# Altium project Infinity.PrjPcb
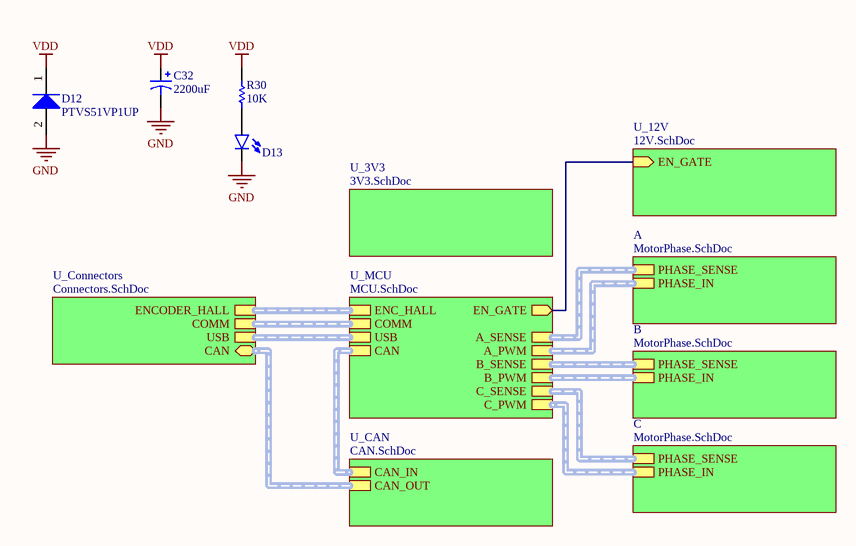
[diagram p0: ESC.SchDoc]
7 sheets, 131 parts. Net scope: hierarchical (ports join the sheet entries above them; power ports are global).
Board file: ESC.PcbDoc
Sheets:
  ESC.SchDoc
    U_12V = 12V.SchDoc
    U_3V3 = 3V3.SchDoc
    U_MCU = MCU.SchDoc
    U_CAN = CAN.SchDoc
    U_Connectors = Connectors.SchDoc
    A = MotorPhase.SchDoc
    B = MotorPhase.SchDoc
    C = MotorPhase.SchDoc

## Sheet ESC.SchDoc
size A; DocumentNumber: 1; SheetNumber: 1; SheetTotal: 6

### Parts
C32  value 2200uF  [CAP-RADIAL-HORZ [18x35.5]]  (hidden comment: CAP 2200uF)
D12  PTVS51VP1UP  [SOD-128]
D13  LED-BLUE  [LED0603]  (value not drawn)
R30  value 10K  [R0603[1608]]  (hidden comment: 10K 1% 0603)

### Sub-sheets
A = MotorPhase.SchDoc: PHASE_SENSE (harness Phase Sense), PHASE_IN (harness Phase Input)
B = MotorPhase.SchDoc: PHASE_SENSE (harness Phase Sense), PHASE_IN (harness Phase Input)
C = MotorPhase.SchDoc: PHASE_SENSE (harness Phase Sense), PHASE_IN (harness Phase Input)
U_3V3 = 3V3.SchDoc: no entries
U_12V = 12V.SchDoc: EN_GATE (in)
U_CAN = CAN.SchDoc: CAN_IN (harness CAN Input), CAN_OUT (harness CAN Output)
U_Connectors = Connectors.SchDoc: USB (harness USB), ENCODER_HALL (harness Encoder/Hall), COMM (harness Comm), CAN
U_MCU = MCU.SchDoc: EN_GATE (out), A_SENSE (harness Phase Sense), A_PWM (harness Phase Input), ENC_HALL (harness Encoder/Hall), COMM (harness Comm), CAN (harness CAN Input), USB (harness USB), B_SENSE (harness Phase Sense), B_PWM (harness Phase Input), C_SENSE (harness Phase Sense), C_PWM (harness Phase Input)

### Nets
GND: C32.2 D12.2(A) D13.C
VDD: C32.1 D12.1(K) R30.2
NetD13_A: D13.A R30.1
NetQ6_1: sheet U_12V/EN_GATE, sheet U_MCU/EN_GATE

### Buses and harness runs
harness sheet A/PHASE_IN = sheet U_MCU/A_PWM
harness sheet A/PHASE_SENSE = sheet U_MCU/A_SENSE
harness sheet B/PHASE_IN = sheet U_MCU/B_PWM
harness sheet B/PHASE_SENSE = sheet U_MCU/B_SENSE
harness sheet C/PHASE_IN = sheet U_MCU/C_PWM
harness sheet C/PHASE_SENSE = sheet U_MCU/C_SENSE
harness sheet U_CAN/CAN_IN = sheet U_MCU/CAN
harness sheet U_CAN/CAN_OUT = sheet U_Connectors/CAN
harness sheet U_Connectors/COMM = sheet U_MCU/COMM
harness sheet U_Connectors/ENCODER_HALL = sheet U_MCU/ENC_HALL
harness sheet U_Connectors/USB = sheet U_MCU/USB

### Library data of the parts
C32 = CAP 2200uF: PartNumber: UVR1J222MHD; Manufacturer: Nichicon; Voltage: 63V; Tolerance: 20%; PackageReference: Radial Capacitor,18x35.5mm; PackageDescription: Radial Capacitor,18x35.5mm, Lead Spacing 7.5mm; Mounting Technology: Through Hole
D12 = PTVS51VP1UP,115: Manufacturer: NXP; PartNumber: PTVS51VP1UP,115; PackageReference: SOD-128; PackageDescription: SOD128, 2-Leads; Mounting Technology: Surface Mount
D13 = LED_0603_BLUE_5mA: PartNumber: LTST-C193TBKT-5A; Manufacturer: Lite-On Inc.; PackageReference: 0603; PackageDescription: 0603 (1608 Metric); Mounting Technology: Surface Mount
R30 = RES_10K_0603_1%: 10K 0.25W 1% 0603 (1005 Metric); Manufacturer: Vishay; PartNumber: RCS060310K0FKEA; Tolerance: 1%; Power: 0.25W; Mounting Technology: Surface Mount; PackageReference: 0603; PackageDescription: 0603 (1608 Metric); ComponentLink1Description: Datasheet; ComponentLink1URL: http://www.vishay.com/docs/20065/rcse3.pdf

## Sheet 12V.SchDoc
size A; DocumentNumber: 4; SheetNumber: 4; SheetTotal: 6
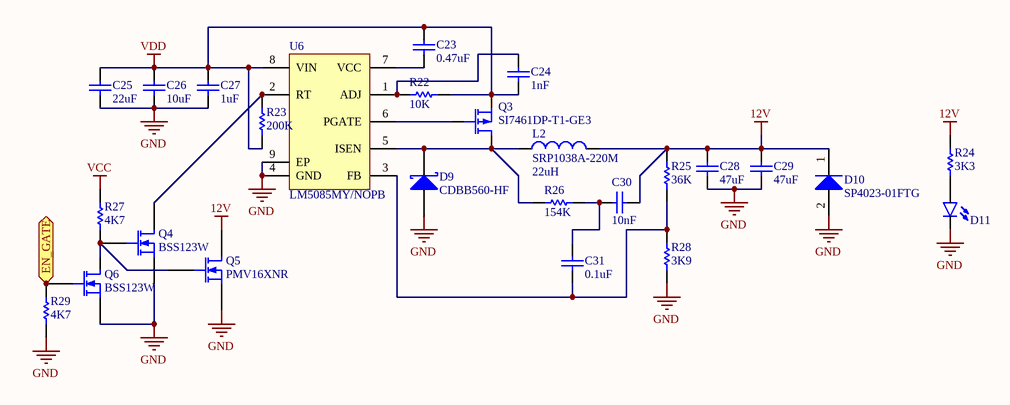
[diagram p1: 12V.SchDoc]

### Parts
(Parts that share a designator on the sheet are numbered #1, #2 ... from top to bottom, then left to right.)
C23  value 0.47uF  [C0603[1608X92]]  (hidden comment: 0.47uF 50V 0603)
C24  value 1nF  [C0402[1005X55]]  (hidden comment: 1nF 50V 0402)
C25#1  value 22uF  [C2220[5750X480]]  (hidden comment: 22uF 50V 2220)
C26  value 10uF  [C1206[3216X160]]  (hidden comment: 10uF 50V 1206)
C27  value 1uF  [C0603[1608X92]]  (hidden comment: 1uF 50V 0603)
C28  value 47uF  [C1210[3225X250]]  (hidden comment: 47uF 16V 1210)
C29  value 47uF  [C1210[3225X250]]  (hidden comment: 47uF 16V 1210)
C30  value 10nF  [C0402[1005X55]]  (hidden comment: 10nF 50V 0402)
C31  value 0.1uF  [C0402[1005X55]]  (hidden comment: 0.1uF 100VV 0402)
D9  CDBB560-HF  [SMB]
D10  SP4023-01FTG  [SOD323]
D11  LED-BLUE  [LED0603]  (value not drawn)
L2  SRP1038A-220M  value 22uH  [SRP1038A]
Q3  SI7461DP-T1-GE3  [SOT23-3]
Q4#1  BSS123W  [SOT323-3]
Q5  PMV16XNR  [SOT23-3]
Q6  BSS123W  [DPAK127P1525X483-7N]
R22  value 10K  [R0402[1005]]  (hidden comment: 10K 1% 0402)
R23  value 200K  [R0402[1005]]  (hidden comment: 200K 1% 0402)
R24  value 3K3  [R0402[1005]]  (hidden comment: 3K3 1% 0402)
R25  value 36K  [R0402[1005]]  (hidden comment: 36K 1% 0402)
R26  value 154K  [R0402[1005]]  (hidden comment: 154K 1% 0402)
R27  value 4K7  [R0402[1005]]  (hidden comment: 4K7 1% 0402)
R28#1  value 3K9  [R0402[1005]]  (hidden comment: 3K9 1% 0402)
R29  value 4K7  [R0402[1005]]  (hidden comment: 4K7 1% 0402)
U6  LM5085MY/NOPB  [MUY08A_N]

### Ports
EN_GATE (in)

### Nets
12V: C28.2 C29.2 C30.2 D10.1(K) L2.2 Q5.3(D) R24.2 R25.2
GND: C25#1.1 C26.1 C27.1 C28.1 C29.1 D9.1(A) D10.2(A) D11.C Q4#1.2(S) Q5.2(S) Q6.2(S) R28#1.1 R29.1 U6.4(GND) U6.9(EP)
VCC: R27.2
VDD: C23.2 C24.1 C25#1.2 C26.2 C27.2 Q3.3(S) R22.2 R23.1 U6.8(VIN)
NetC23_1: C23.1 U6.7(VCC)
NetC24_2: C24.2 R22.1 U6.1(ADJ)
NetC30_1: C30.1 C31.2 R26.2
NetC31_1: C31.1 R25.1 R28#1.2 U6.3(FB)
NetD9_2: D9.2(K) L2.1 Q3.2(D) R26.1 U6.5(ISEN)
NetD11_A: D11.A R24.1
NetQ3_1: Q3.1(G) U6.6(PGATE)
NetQ4#1_1: Q4#1.1(G) Q5.1(G) Q6.3(D) R27.1
NetQ4#1_3: Q4#1.3(D) R23.2 U6.2(RT)
NetQ6_1: Q6.1(G) R29.2 ; port EN_GATE

### Library data of the parts
C23 = CAP_0.47uF_50V_0603_10%: 0.47uF 50V 10% 0603 (1608 Metric); PartNumber: GRM188R61H474KA12D; Manufacturer: Murata; Tolerance: 10%; Mounting Technology: Surface Mount; PackageReference: 0603; PackageDescription: 0603 (1608 Metric); Voltage: 50V
C24 = CAP_1nF_50V_0402_5%: 1nF 50V 5% 0402 (1005 Metric); PartNumber: GRM1555C1H102JA01D; Manufacturer: Murata; Tolerance: 5%; Mounting Technology: Surface Mount; PackageReference: 0402; PackageDescription: 0402 (1005 Metric); Voltage: 50V
C25#1 = CAP_22uF_50V_2220_20%: 22uF 50V 20% 2220 (5750 Metric); PartNumber: KRM55TR71H226MH01K; Manufacturer: Murata; Tolerance: 20%; Mounting Technology: Surface Mount; PackageReference: 2220; PackageDescription: 2220 (5750 Metric); Voltage: 50V
C26 = CAP_10uF_50V_1206_20%: 10uF 50V 20% 1206 (3216 Metric); PartNumber: UMK316BBJ106ML-T; Manufacturer: Taiyo Yuden; Tolerance: 20%; Mounting Technology: Surface Mount; PackageReference: 1206; PackageDescription: 1206 (3216 Metric); Voltage: 50V
C27 = CAP_1uF_50V_0603_10%: 1uF 50V 10% 0603 (1608 Metric); PartNumber: GRM188R61H105KAALD; Manufacturer: Murata; Tolerance: 10%; Mounting Technology: Surface Mount; PackageReference: 0603; PackageDescription: 0603 (1608 Metric); Voltage: 50V
C28 C29 = CAP_47uF_16V_1210_20%: 47uF 16V 20% 1210 (3225 Metric); PartNumber: GRM32ER61C476ME15L; Manufacturer: Murata; Tolerance: 20%; Mounting Technology: Surface Mount; PackageReference: 1210; PackageDescription: 1210 (3225 Metric); Voltage: 16V
C30 = CAP_10nF_50V_0402_10%: 10nF 50V 10% 0402 (1005 Metric); PartNumber: GCM155R71H103KA55D; Manufacturer: Murata; Tolerance: 10%; Mounting Technology: Surface Mount; PackageReference: 0402; PackageDescription: 0402 (1005 Metric); Voltage: 50V
C31 = CAP_0.1uF_100V_0402_10%: 0.1uF 100V 10% 0402 (1005 Metric); PartNumber: GRM155R62A104KE14D; Manufacturer: Murata; Tolerance: 10%; Mounting Technology: Surface Mount; PackageReference: 0402; PackageDescription: 0402 (1005 Metric); Voltage: 100V
D9 = CDBB560-HF: Manufacturer: Comchip Technology; PackageReference: DO-214AA; PackageDescription: DO-214-AA/SMB; 2 C-Bend Leads; Body 5.3 x 3.6 mm, inc. leads (LxW); PartNumber: CDBB560-HF; Mounting Technology: Surface Mount
D10 = SP4023-01FTG: Manufacturer: Littelfuse; PartNumber: SP4023-01FTG; PackageReference: SOD-323-2; PackageDescription: SOD323, 2-Leads; Mounting Technology: Surface Mount
D11 = LED_0603_BLUE_5mA: as D13 on sheet ESC; PackageReference: 0603; PackageDescription: 0603 (1608 Metric); Mounting Technology: Surface Mount
L2 = SRP1038A-220M: 22uH 20% 7A 1038; Manufacturer: Bourns; PackageReference: SRP1038A; PartNumber: SRP1038A-220M; Mounting Technology: Surface Mount
Q3 = SI7461DP-T1-GE3: P-Channel MOSFET; Manufacturer: Vishay; PackageReference: PowerPAK SO-8; PartNumber: SI7461DP-T1-GE3; Mounting Technology: Surface Mount
Q4#1 Q6 = BSS123WQ-7-F: N-Channel MOSFET; Manufacturer: Diodes Incorporated; PackageReference: SOT-323-3; PartNumber: BSS123WQ-7-F; Mounting Technology: Surface Mount
Q5 = PMV16XNR: N-Channel MOSFET; pin to pad: 2>3 3>2; Manufacturer: NXP; PackageReference: SOT-23-3; PartNumber: PMV16XNR; Mounting Technology: Surface Mount
R22 = RES_10K_0402_1%: 10K 0.063W 1% 0402 (1005 Metric); Manufacturer: KOA Speer; PartNumber: RK73H1ETTP1002F; Tolerance: 1%; Power: 0.063W; Mounting Technology: Surface Mount; PackageReference: 0402; PackageDescription: 0402 (1005 Metric); ComponentLink1Description: Datasheet; ComponentLink1URL: http://www.koaspeer.com/catimages/Products/RK73H/RK73H.pdf
R23 = RES_200K_0402_1%: 200K 0.063W 1% 0402 (1005 Metric); Manufacturer: KOA Speer; PartNumber: RK73H1ETTP2003F; Tolerance: 1%; Power: 0.063W; Mounting Technology: Surface Mount; PackageReference: 0402; PackageDescription: 0402 (1005 Metric); ComponentLink1Description: Datasheet; ComponentLink1URL: http://www.koaspeer.com/catimages/Products/RK73H/RK73H.pdf
R24 = RES_3K3_0402_1%: 3K3 0.063W 1% 0402 (1005 Metric); Manufacturer: KOA Speer; PartNumber: RK73H1ETTP3301F; Power: 0.063W; Tolerance: 1%; Mounting Technology: Surface Mount; PackageReference: 0402; PackageDescription: 0402 (1005 Metric); ComponentLink1Description: Datasheet; ComponentLink1URL: http://www.koaspeer.com/catimages/Products/RK73H/RK73H.pdf
R25 = RES_36K_0402_1%: 36K 0.063W 1% 0402 (1005 Metric); Manufacturer: KOA Speer; PartNumber: RK73H1ETTP3602F; Power: 0.063W; Tolerance: 1%; Mounting Technology: Surface Mount; PackageReference: 0402; PackageDescription: 0402 (1005 Metric); ComponentLink1Description: Datasheet; ComponentLink1URL: http://www.koaspeer.com/catimages/Products/RK73H/RK73H.pdf
R26 = RES_154K_0402_1%: 154K 0.063W 1% 0402 (1005 Metric); Manufacturer: KOA Speer; PartNumber: RK73H1ETTP1543F; Power: 0.063W; Tolerance: 1%; Mounting Technology: Surface Mount; PackageReference: 0402; PackageDescription: 0402 (1005 Metric); ComponentLink1Description: Datasheet; ComponentLink1URL: http://www.koaspeer.com/catimages/Products/RK73H/RK73H.pdf
R27 R29 = RES_4K7_0402_1%: 4K7 0.063W 1% 0402 (1005 Metric); Manufacturer: KOA Speer; PartNumber: RK73H1ETTP4701F; Tolerance: 1%; Power: 0.063W; Mounting Technology: Surface Mount; PackageReference: 0402; PackageDescription: 0402 (1005 Metric); ComponentLink1Description: Datasheet; ComponentLink1URL: http://www.koaspeer.com/catimages/Products/RK73H/RK73H.pdf
R28#1 = RES_3K9_0402_1%: 3K9 0.063W 1% 0402 (1005 Metric); Manufacturer: KOA Speer; PartNumber: RK73H1ETTP3901F; Tolerance: 1%; Power: 0.063W; Mounting Technology: Surface Mount; PackageReference: 0402; PackageDescription: 0402 (1005 Metric); ComponentLink1Description: Datasheet; ComponentLink1URL: http://www.koaspeer.com/catimages/Products/RK73H/RK73H.pdf
U6 = CMP-0069-01314-2: 75V Constant On-Time PFET Buck Switching Controller, 8-pin eMSOP, Pb-Free; Manufacturer: Texas Instruments; CompType: Switcher; PackageTopMarking: ZXTT*SYCB; PowerWise: Y; ComponentLink3Description: MUY08A Package Page; ComponentLink1URL: http://www.national.com/ds/LM/LM5085.pdf; PackageReference: MSOP-8; RevisionNote: Component URLs added; ComponentLink3URL: http://www.national.com/packaging/folders/muy08a.html; DatasheetVersion: Dec-2009; ComponentLink1Description: LM5085 Datasheet; ComponentLink2URL: http://www.national.com/pf/LM/LM5085.html; RoHS: Y; PackageVersion: revA, Nov-2003; Code_JEDEC: MO-187-AA; PackageDescription: Molded Mini-SO, Exposed Pad, .118 x .118 x .034in Body, 8 Lead, .0256in Pitch; ComponentLink2Description: LM5085 Web Page; PinCount: 8; Mounting Technology: Surface Mount; PartNumber: LM5085MY

## Sheet 3V3.SchDoc
size A; DocumentNumber: 5; SheetNumber: 5; SheetTotal: 6
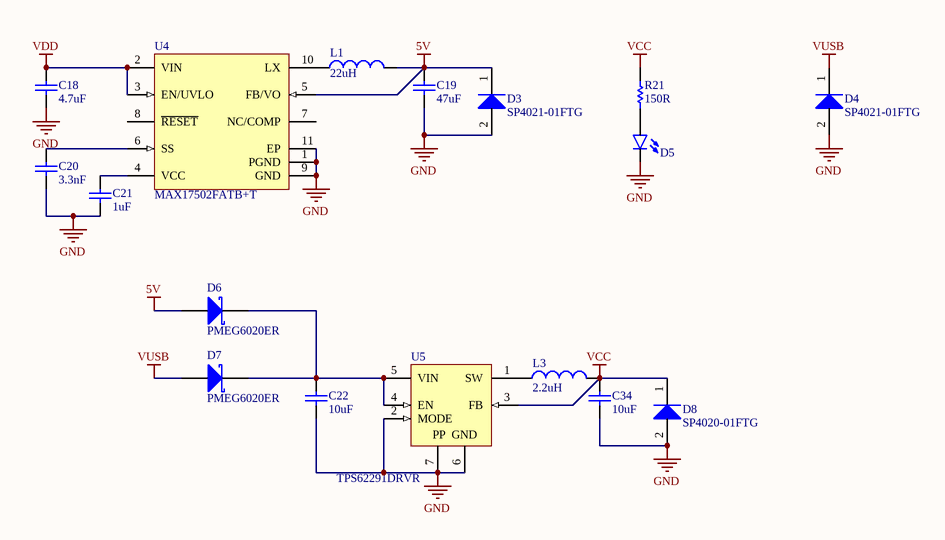
[diagram p2: 3V3.SchDoc]

### Parts
(Parts that share a designator on the sheet are numbered #1, #2 ... from top to bottom, then left to right.)
C18  value 4.7uF  [C1210[3225X200]]  (hidden comment: 4.7uF 100V 1210)
C19  value 47uF  [C1210[3225X250]]  (hidden comment: 47uF 6.3V 1210)
C20  value 3.3nF  [C0402[1005X55]]  (hidden comment: 3.3nF 50V 0402)
C21  value 1uF  [C0402[1005X55]]  (hidden comment: 1uF 6.3V 0402)
C22  value 10uF  [C0402[1005X55]]  (hidden comment: 10uF 6.3V 0402)
C34  value 10uF  [C0402[1005X55]]  (hidden comment: 10uF 6.3V 0402)
D3#1  SP4021-01FTG  [SOD323]
D4  SP4021-01FTG  [SOD323]
D5  LED-BLUE  [LED0603]  (value not drawn)
D6  PMEG6020ER  [ONSC-SOD-123-2-425-04_V]
D7  PMEG6020ER  [ONSC-SOD-123-2-425-04_V]
D8  SP4020-01FTG  [SOD323]
L1  value 22uH  [SDR0805-180ML]
L3  2.2uH  [IND0805]
R21  value 150R  [R0402[1005]]  (hidden comment: 150R 1% 0402)
U4#1  MAX17502FATB+T  [TDFN-10-EP]
U5  TPS62291DRVR  [WSON-6]

### Nets
5V: C19.2 D3#1.1(K) D6.2(A) L1.2 U4#1.5(FB/VO)
GND: C18.1 C19.1 C20.1 C21.1 C22.1 C34.1 D3#1.2(A) D4.2(A) D5.C D8.2(A) U4#1.1(PGND) U4#1.9(GND) U4#1.11(EP) U5.2(MODE) U5.6(GND) U5.7(EP)
VCC: C34.2 D8.1(K) L3.2 R21.2 U5.3(FB)
VDD: C18.2 U4#1.2(VIN) U4#1.3(EN/UVLO)
VUSB: D4.1(K) D7.2(A)
NetC20_2: C20.2 U4#1.6(SS)
NetC21_2: C21.2 U4#1.4(VCC)
NetC22_2: C22.2 D6.1(K) D7.1(K) U5.4(EN) U5.5(VIN)
NetD5_A: D5.A R21.1
NetL1_1: L1.1 U4#1.10(LX)
NetL3_1: L3.1 U5.1(SW)

Not connected (* = marked no-connect by the designer): U4#1 7(NC/COMP) 8(~{RESET})

### Notes on the sheet
- (in symbol TPS62291DRVR) PP

### Library data of the parts
C18 = CAP_4.7uF_100V_1210_10%: 4.7uF 100V 10% 1210 (3225 Metric); PartNumber: GRJ32DC72A475KE11L; Manufacturer: Murata; Tolerance: 10%; Mounting Technology: Surface Mount; PackageReference: 1210; PackageDescription: 1210 (3225 Metric); Voltage: 100V
C19 = CAP_47uF_6.3V_1210_10%: 47uF 6.3V 10% 1210 (3225 Metric); PartNumber: GRM32ER70J476KE20L; Manufacturer: Murata; Tolerance: 10%; Mounting Technology: Surface Mount; PackageReference: 1210; PackageDescription: 1210 (3225 Metric); Voltage: 6.3V
C20 = CAP_3.3nF_50V_0402_10%: 3.3nF 50V 10% 0402 (1005 Metric); PartNumber: GRM155R71H332KA01D; Manufacturer: Murata; Tolerance: 10%; Mounting Technology: Surface Mount; PackageReference: 0402; PackageDescription: 0402 (1005 Metric); Voltage: 50V
C21 = CAP_1uF_6.3V_0402_10%: 1uF 6.3V 10% 0402 (1005 Metric); PartNumber: GRM155R70J105KA12D; Manufacturer: Murata; Tolerance: 10%; Mounting Technology: Surface Mount; PackageReference: 0402; PackageDescription: 0402 (1005 Metric); Voltage: 6.3V
C22 C34 = CAP_10uF_6.3V_0402_20%: 10uF 6.3V 20% 0402 (1005 Metric); PartNumber: GRM155R60J106ME44D; Manufacturer: Murata; Tolerance: 20%; Mounting Technology: Surface Mount; PackageReference: 0402; PackageDescription: 0402 (1005 Metric); Voltage: 6.3V
D3#1 D4 = SP4021-01FTG: Manufacturer: Littelfuse; PartNumber: SP4021-01FTG; PackageReference: SOD-323-2; Mounting Technology: Surface Mount
D5 = LED_0603_BLUE_5mA: as D13 on sheet ESC; PackageReference: 0603; PackageDescription: 0603 (1608 Metric); Mounting Technology: Surface Mount
D6 D7 = PMEG6020ER: PartNumber: PMEG6020ER,115; Manufacturer: NXP Semiconductors; PackageReference: SOD-123W; PackageDescription: SOD, 2-Leads, Body 2.69x1.6mm; Mounting Technology: Surface Mount
D8 = SP4020-01FTG: Manufacturer: Littelfuse; PartNumber: SP4020-01FTG; PackageReference: SOD-323-2; Mounting Technology: Surface Mount
L1 = SDR0604-220YL: 22uH 30% 1.1A 0604; Manufacturer: Bourns; PackageReference: SDR0604; PartNumber: SDR0604-220YL; Mounting Technology: Surface Mount
L3 = IND_2.2uH_1.7A_0805_20%: 2.2uH 20% 1.7A 0805; PartNumber: LQM21PN2R2MGHL; Manufacturer: Murata; PackageReference: 0805; PackageDescription: 0805 (2012 metric); Value: 2.2uH; Mounting Technology: Surface Mount; Current: 1.7A
R21 = RES_150R_0402_1%: 150R 0.063W 1% 0402 (1005 Metric); Manufacturer: KOA Speer; PartNumber: RK73H1ETTP1500F; Power: 0.063W; Tolerance: 1%; Mounting Technology: Surface Mount; PackageReference: 0402; PackageDescription: 0402 (1005 Metric); ComponentLink1Description: Datasheet; ComponentLink1URL: http://www.koaspeer.com/catimages/Products/RK73H/RK73H.pdf
U4#1 = MAX17502FATB+T: Manufacturer: Maxim Integrated; Mounting Technology: Surface Mount; PartNumber: MAX17502FATB+T; PackageReference: TDFN-10-EP
U5 = TPS62291DRVR: Voltage Regulators - Switching Regulators 2.25MHz 1A Step-Down Cnvrtr 3.3V Output; Manufacturer: Texas Instruments; PartNumber: TPS62291DRVR; PackageReference: WSON-6; PackageDescription: SON, 6-Leads, Body 2x2mm, Pitch 0.65mm, Thermal Pad 1.6x1mm, TI Recommended; Mounting Technology: Surface Mount

## Sheet MCU.SchDoc
size A; DocumentNumber: 2; SheetNumber: 2; SheetTotal: 6
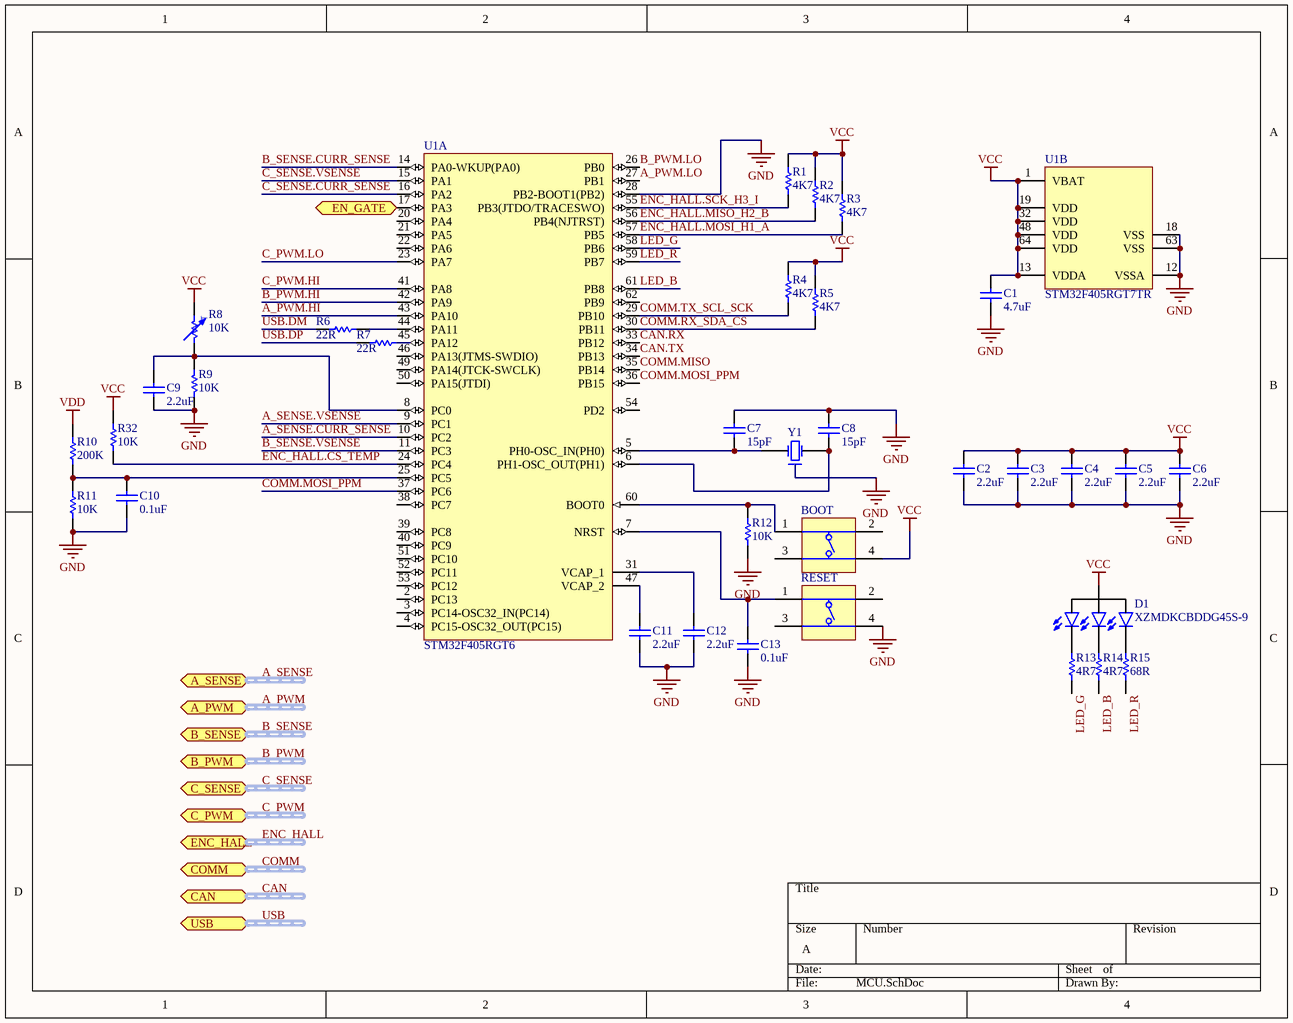
[diagram p3: MCU.SchDoc]

### Parts
(Parts that share a designator on the sheet are numbered #1, #2 ... from top to bottom, then left to right.)
BOOT  (no value)  [SWITCH]
C1  value 4.7uF  [C0402[1005X55]]  (hidden comment: 4.7uF 6.3V 0402)
C2  value 2.2uF  [C0402[1005X55]]  (hidden comment: 2.2uF 6.3V 0402)
C3  value 2.2uF  [C0402[1005X55]]  (hidden comment: 2.2uF 6.3V 0402)
C4  value 2.2uF  [C0402[1005X55]]  (hidden comment: 2.2uF 6.3V 0402)
C5  value 2.2uF  [C0402[1005X55]]  (hidden comment: 2.2uF 6.3V 0402)
C6  value 2.2uF  [C0402[1005X55]]  (hidden comment: 2.2uF 6.3V 0402)
C7  value 15pF  [C0402[1005X55]]  (hidden comment: 15pF 50V 0402)
C8  value 15pF  [C0402[1005X55]]  (hidden comment: 15pF 50V 0402)
C9  value 2.2uF  [C0402[1005X55]]  (hidden comment: 2.2uF 6.3V 0402)
C10  value 0.1uF  [C0402[1005X55]]  (hidden comment: 0.1uF 6.3V 0402)
C11  value 2.2uF  [C0402[1005X55]]  (hidden comment: 2.2uF 6.3V 0402)
C12  value 2.2uF  [C0402[1005X55]]  (hidden comment: 2.2uF 6.3V 0402)
C13  value 0.1uF  [C0402[1005X55]]  (hidden comment: 0.1uF 6.3V 0402)
D1  XZMDKCBDDG45S-9  [XZMDKCBDDG45S-9]
R1  value 4K7  [R0402[1005]]  (hidden comment: 4K7 1% 0402)
R2  value 4K7  [R0402[1005]]  (hidden comment: 4K7 1% 0402)
R3  value 4K7  [R0402[1005]]  (hidden comment: 4K7 1% 0402)
R4  value 4K7  [R0402[1005]]  (hidden comment: 4K7 1% 0402)
R5  value 4K7  [R0402[1005]]  (hidden comment: 4K7 1% 0402)
R6  value 22R  [R0402[1005]]  (hidden comment: 22R 1% 0402)
R7#1  value 22R  [R0402[1005]]  (hidden comment: 22R 1% 0402)
R8  value 10K  [R0402[1005]]  (hidden comment: 10K 0.5% 0402)
R9  value 10K  [R0402[1005]]  (hidden comment: 10K 1% 0402)
R10#1  value 200K  [R0402[1005]]  (hidden comment: 200K 1% 0402)
R11  value 10K  [R0402[1005]]  (hidden comment: 10K 1% 0402)
R12  value 10K  [R0402[1005]]  (hidden comment: 10K 1% 0402)
R13#1  value 4R7  [R0402[1005]]  (hidden comment: 4R7 1% 0402)
R14  value 4R7  [R0402[1005]]  (hidden comment: 4R7 1% 0402)
R15  value 68R  [R0402[1005]]  (hidden comment: 68R 1% 0402)
R32  value 10K  [R0402[1005]]  (hidden comment: 10K 1% 0402)
RESET  (no value)  [SWITCH]
U1#1  STM32F405RGT6  [STM-LQFP64_L]  (part A of 2)
U1#2  STM32F405RGT7TR  [STM-LQFP64_V]  (part B of 2)
Y1  (no value)  [ABRA-ABM3B-4_V]

### Ports
A_PWM (harness Phase Input), A_SENSE (harness Phase Sense), B_PWM (harness Phase Input), B_SENSE (harness Phase Sense), C_PWM (harness Phase Input), C_SENSE (harness Phase Sense), CAN (harness CAN Input), COMM (harness Comm), EN_GATE (out), ENC_HALL (harness Encoder/Hall), USB (harness USB)

### Nets
GND: C1.1 C2.1 C3.1 C4.1 C5.1 C6.1 C7.2 C8.2 C9.1 C10.1 C11.1 C12.1 C13.1 R9.1 R11.1 R12.1 RESET.4(T3) U1#1.28(PB2-BOOT1(PB2)) U1#2.12(VSSA) U1#2.18(VSS) U1#2.63(VSS) Y1.2
VCC: BOOT.4(T3) C1.2 C2.2 C3.2 C4.2 C5.2 C6.2 D1.2(A) R1.2 R2.2 R3.2 R4.2 R5.2 R8.2 R32.2 U1#2.1(VBAT) U1#2.13(VDDA) U1#2.19(VDD) U1#2.32(VDD) U1#2.48(VDD) U1#2.64(VDD)
VDD: R10#1.1
A_PWM.HI: U1#1.43(PA10)
A_PWM.LO: U1#1.27(PB1)
A_SENSE.CURR_SENSE: U1#1.10(PC2)
A_SENSE.VSENSE: U1#1.9(PC1)
B_PWM.HI: U1#1.42(PA9)
B_PWM.LO: U1#1.26(PB0)
B_SENSE.CURR_SENSE: U1#1.14(PA0-WKUP(PA0))
B_SENSE.VSENSE: U1#1.11(PC3)
C_PWM.HI: U1#1.41(PA8)
C_PWM.LO: U1#1.23(PA7)
C_SENSE.CURR_SENSE: U1#1.16(PA2)
C_SENSE.VSENSE: U1#1.15(PA1)
CAN.RX: U1#1.33(PB12)
CAN.TX: U1#1.34(PB13)
COMM.MISO: U1#1.35(PB14)
COMM.MOSI_PPM: U1#1.36(PB15) U1#1.37(PC6)
COMM.RX_SDA_CS: R5.1 U1#1.30(PB11)
COMM.TX_SCL_SCK: R4.1 U1#1.29(PB10)
ENC_HALL.CS_TEMP: R32.1 U1#1.24(PC4)
ENC_HALL.MISO_H2_B: R2.1 U1#1.56(PB4(NJTRST))
ENC_HALL.MOSI_H1_A: R3.1 U1#1.57(PB5)
ENC_HALL.SCK_H3_I: R1.1 U1#1.55(PB3(JTDO/TRACESWO))
LED_B: R14.1 U1#1.61(PB8)
LED_G: R13#1.1 U1#1.58(PB6)
LED_R: R15.1 U1#1.59(PB7)
USB.DM: R6.1
USB.DP: R7#1.1
NetBOOT_1: BOOT.1(T1) R12.2 U1#1.60(BOOT0)
NetC7_1: C7.1 U1#1.5(PH0-OSC_IN(PH0)) Y1.3(X2)
NetC8_1: C8.1 U1#1.6(PH1-OSC_OUT(PH1)) Y1.1(X1)
NetC9_2: C9.2 R8.1 R9.2 U1#1.8(PC0)
NetC10_2: C10.2 R10#1.2 R11.2 U1#1.25(PC5)
NetC11_2: C11.2 U1#1.47(VCAP_2)
NetC12_2: C12.2 U1#1.31(VCAP_1)
NetC13_2: C13.2 RESET.1(T1) U1#1.7(NRST)
NetD1_1: D1.1(K_Red) R15.2
NetD1_3: D1.3(K_Blue) R14.2
NetD1_4: D1.4(K_Green) R13#1.2
NetQ6_1: U1#1.17(PA3) ; port EN_GATE
NetR6_2: R6.2 U1#1.44(PA11)
NetR7#1_2: R7#1.2 U1#1.45(PA12)

Not connected (* = marked no-connect by the designer): BOOT 2(T2) 3(T3); RESET 2(T2) 3(T3); U1#1 2(PC13) 3(PC14-OSC32_IN(PC14)) 4(PC15-OSC32_OUT(PC15)) 20(PA4) 21(PA5) 22(PA6) 38(PC7) 39(PC8) 40(PC9) 46(PA13(JTMS-SWDIO)) 49(PA14(JTCK-SWCLK)) 50(PA15(JTDI)) 51(PC10) 52(PC11) 53(PC12) 54(PD2) 62(PB9)

### Buses and harness runs
harness A_PWM = port A_PWM
harness A_SENSE = port A_SENSE
harness B_PWM = port B_PWM
harness B_SENSE = port B_SENSE
harness C_PWM = port C_PWM
harness C_SENSE = port C_SENSE
harness CAN = port CAN
harness COMM = port COMM
harness ENC_HALL = port ENC_HALL
harness USB = port USB

### Notes on the sheet
- (in symbol NTC_10K_0402_0.5%) T

### Library data of the parts
BOOT RESET = DIPT-DTSM-6: Switch, SPNO Push Button SMD; Manufacturer: C&K Components; PartNumber: PTS810 SJM 250 SMTR LFS; Packing Type: Tape&Reel; Mechanical Life: 200,000 cycles; ComponentLink2URL: http://www.dip.com.tw/Products_tact.htm; ComponentLink1URL: http://www.dip.com.tw/; ComponentLink3URL: http://www.dip.com.tw/PDF/pro_tact/DTSM_G_-6_2_-V.pdf; PackageDescription: Switch, Surface Mount, 4 Leads, Body 4.6x2.8mm, Height 1.9mm; ComponentLink2Description: Datasheet; ComponentLink3Description: Package Specification; ComponentLink1Description: Manufacturer URL; PackageReference: PTS810; Mounting Technology: Surface Mount
C1 = CAP_4.7uF_6.3V_0402_20%: 4.7uF 6.3V 20% 0402 (1005 Metric); PartNumber: GRM155R60J475ME47D; Manufacturer: Murata; Tolerance: 20%; Mounting Technology: Surface Mount; PackageReference: 0402; PackageDescription: 0402 (1005 Metric); Voltage: 6.3V
C2-C6 C9 C11 C12 = CAP_2.2uF_6.3V_0402_20%: 2.2uF 6.3V 20% 0402 (1005 Metric); PartNumber: GRM155R60J225ME15D; Manufacturer: Murata; Tolerance: 20%; Mounting Technology: Surface Mount; PackageReference: 0402; PackageDescription: 0402 (1005 Metric); Voltage: 6.3V
C7 C8 = CAP_15pF_50V_0402_5%: 15pF 50V 5% 0402 (1005 Metric); PartNumber: GRM1555C1H150JA01D; Manufacturer: Murata; Tolerance: 5%; Mounting Technology: Surface Mount; PackageReference: 0402; PackageDescription: 0402 (1005 Metric); Voltage: 50V
C10 C13 = CAP_0.1uF_6.3V_0402_10%: 0.1uF 6.3V 10% 0402 (1005 Metric); PartNumber: GRM155R70J104KA01D; Manufacturer: Murata; Tolerance: 10%; Mounting Technology: Surface Mount; PackageReference: 0402; PackageDescription: 0402 (1005 Metric); Voltage: 6.3V
D1 = XZMDKCBDDG45S-9: Manufacturer: SunLED; PartNumber: XZMDKCBDDG45S-9; PackageReference: 4-PLCC; Mounting Technology: Surface Mount; PackageDescription: 4-SMD, Gull Wing,  3.20mm L x 2.80mm W
R1-R5 = RES_4K7_0402_1%: as R27 on sheet 12V; Tolerance: 1%; Power: 0.063W; Mounting Technology: Surface Mount; PackageReference: 0402; PackageDescription: 0402 (1005 Metric); ComponentLink1Description: Datasheet; ComponentLink1URL: http://www.koaspeer.com/catimages/Products/RK73H/RK73H.pdf
R6 R7#1 = RES_22R_0402_1%: 22R 0.063W 1% 0402 (1005 Metric); Manufacturer: KOA Speer; PartNumber: RK73H1ETTP22R0F; Power: 0.063W; Tolerance: 1%; Mounting Technology: Surface Mount; PackageReference: 0402; PackageDescription: 0402 (1005 Metric); ComponentLink1Description: Datasheet; ComponentLink1URL: http://www.koaspeer.com/catimages/Products/RK73H/RK73H.pdf
R8 = NTC_10K_0402_0.5%: NTC 10K 0.5% 0402 (1005 Metric); PartNumber: NCP15XH103D03RC; Manufacturer: Murata; Power: 0.1W; Tolerance: 0.5%; Mounting Technology: Surface Mount; PackageReference: 0402; PackageDescription: 0402 (1005 Metric)
R9 R11 R12 R32 = RES_10K_0402_1%: as R22 on sheet 12V; Tolerance: 1%; Power: 0.063W; Mounting Technology: Surface Mount; PackageReference: 0402; PackageDescription: 0402 (1005 Metric); ComponentLink1Description: Datasheet; ComponentLink1URL: http://www.koaspeer.com/catimages/Products/RK73H/RK73H.pdf
R10#1 = RES_200K_0402_1%: as R23 on sheet 12V; Tolerance: 1%; Power: 0.063W; Mounting Technology: Surface Mount; PackageReference: 0402; PackageDescription: 0402 (1005 Metric); ComponentLink1Description: Datasheet; ComponentLink1URL: http://www.koaspeer.com/catimages/Products/RK73H/RK73H.pdf
R13#1 R14 = RES_4R7_0402_1%: 4R7 0.063W 1% 0402 (1005 Metric); Manufacturer: KOA Speer; PartNumber: RK73H1ETTP4R70F; Power: 0.063W; Tolerance: 1%; Mounting Technology: Surface Mount; PackageReference: 0402; PackageDescription: 0402 (1005 Metric); ComponentLink1Description: Datasheet; ComponentLink1URL: http://www.koaspeer.com/catimages/Products/RK73H/RK73H.pdf
R15 = RES_68R_0402_1%: 68R 0.063W 1% 0402 (1005 Metric); Manufacturer: KOA Speer; PartNumber: RK73H1ETTP68R0F; Tolerance: 1%; Power: 0.063W; Mounting Technology: Surface Mount; PackageReference: 0402; PackageDescription: 0402 (1005 Metric); ComponentLink1Description: Datasheet; ComponentLink1URL: http://www.koaspeer.com/catimages/Products/RK73H/RK73H.pdf
U1#1 U1#2 = CMP-0243-00089-2: ARM Cortex-M4 32-bit MCU+FPU, 210 DMIPS, 1024 kB Flash, 192 kB Internal RAM, 51 I/Os, 64-pin LQFP, -40 to 105 degC, Tape and Reel; Manufacturer: STMicroelectronics; FLASH Size (Prog) (kB): 1024; Supply Voltage(Vcc) max (V): 3.6; Internal RAM Size (kB): 192; Supply Voltage(Vcc) min (V): 1.8; Operating Frequency(F) (Processor speed) (MHz): 168; D/A Converter: 2x12-bit; I/Os (High Current): 51; ComponentLink2Description: Datasheet; Core: ARM Cortex-M4; PackageVersion: Rev. 4, 06/2013; ComponentLink1URL: http://www.st.com/web/en/home.html; PackageReference: LQFP64; Mounting Technology: Surface Mount; ComponentLink1Description: Manufacturer URL; PackageDescription: 64-Pin Low Profile Quad Flat Package, 10 x 10 mm Body, 0.5 mm Pitch; ComponentLink3Description: Package Specification; ComponentLink2URL: http://www.st.com/st-web-ui/static/active/en/resource/technical/document/datasheet/DM00037051.pdf; ComponentLink3URL: http://www.st.com/st-web-ui/static/active/en/resource/technical/document/datasheet/DM00037051.pdf; Packing: Tape and Reel; DatasheetVersion: Rev. 4; PartId: 1
  U1#1: PartNumber: STM32F405RGT6
  U1#2: PartNumber: STM32F405RGT7TR
Y1 = ABRA-ABM3B-4: PartNumber: ABM3B-8.000MHZ-10-1UT; Manufacturer: ABRACON; Mounting Technology: Surface Mount; PackageReference: 2012; PackageDescription: 2012 (5032 metric)

## Sheet CAN.SchDoc
size A
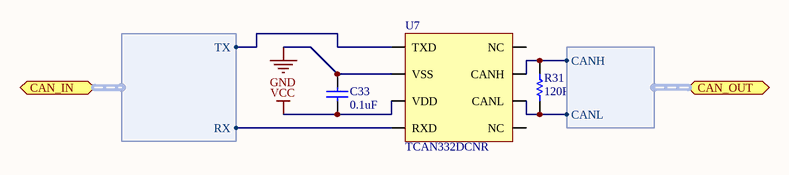
[diagram p4: CAN.SchDoc]

### Parts
(Parts that share a designator on the sheet are numbered #1, #2 ... from top to bottom, then left to right.)
C33#1  value 0.1uF  [C0402[1005X55]]  (hidden comment: 0.1uF 6.3V 0402)
R31#1  value 120R  [R0402[1005]]  (hidden comment: 120R 1% 0402)
U7  TCAN332DCNR  [SOT-23-8]

### Ports
CAN_IN (harness CAN Input), CAN_OUT (harness CAN Output)

### Harnesses
CAN Input: TX, RX
CAN Output: CANH, CANL

### Nets
GND: C33#1.1 U7.2(VSS)
VCC: C33#1.2 U7.3(VDD)
CAN.RX: U7.4(RXD) ; port CAN_IN.RX
CAN.TX: U7.1(TXD) ; port CAN_IN.TX
NetJP4_1: R31#1.2 U7.7(CANH) ; port CAN_OUT.CANH
NetJP4_2: R31#1.1 U7.6(CANL) ; port CAN_OUT.CANL

Not connected (* = marked no-connect by the designer): U7 5(NC) 8(NC)

### Library data of the parts
C33#1 = CAP_0.1uF_6.3V_0402_10%: as C10 on sheet MCU; Tolerance: 10%; Mounting Technology: Surface Mount; PackageReference: 0402; PackageDescription: 0402 (1005 Metric); Voltage: 6.3V
R31#1 = RES_120R_0402_1%: 120R 0.063W 1% 0402 (1005 Metric); Manufacturer: KOA Speer; PartNumber: RK73H1ETTP1200F; Tolerance: 1%; Power: 0.063W; Mounting Technology: Surface Mount; PackageReference: 0402; PackageDescription: 0402 (1005 Metric); ComponentLink1Description: Datasheet; ComponentLink1URL: http://www.koaspeer.com/catimages/Products/RK73H/RK73H.pdf
U7 = TCAN332DCNR: CAN Interface IC 3.3-V CAN Transceivers with CAN FD (Flexible Data Rate) 8-SOT-23 -40 to 125; Manufacturer: Texas Instruments; Mounting Technology: Surface Mount; PackageReference: SOT-23-8; PartNumber: TCAN332DCNR; PackageDescription: SOT23, 8-Leads

## Sheet Connectors.SchDoc
size A; DocumentNumber: 6; SheetNumber: 6; SheetTotal: 6
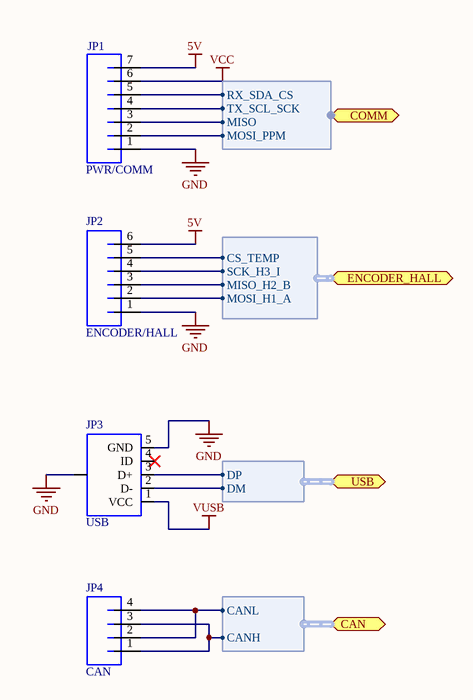
[diagram p5: Connectors.SchDoc]

### Parts
JP1  PWR/COMM  [JST-PH-7-PTH-VERT]
JP2  ENCODER/HALL  [JST-PH-6-PTH-VERT]
JP3  USB  [USB-MICROB]
JP4  CAN  [JST-PH-4-PTH-VERT]

### Ports
CAN (harness CAN Output), COMM (harness Comm), ENCODER_HALL (harness Encoder/Hall), USB (harness USB)

### Harnesses
CAN Output: CANL, CANH
USB: DP, DM
Encoder/Hall: CS_TEMP, SCK_H3_I, MISO_H2_B, MOSI_H1_A
Comm: RX_SDA_CS, TX_SCL_SCK, MISO, MOSI_PPM

### Nets
5V: JP1.7 JP2.6
GND: JP1.1 JP2.1 JP3.5(GND) JP3.6(SHIELD)
VCC: JP1.6
VUSB: JP3.1(VCC)
COMM.MISO: JP1.3 ; port COMM.MISO
COMM.MOSI_PPM: JP1.2 ; port COMM.MOSI_PPM
COMM.RX_SDA_CS: JP1.5 ; port COMM.RX_SDA_CS
COMM.TX_SCL_SCK: JP1.4 ; port COMM.TX_SCL_SCK
ENC_HALL.CS_TEMP: JP2.5 ; port ENCODER_HALL.CS_TEMP
ENC_HALL.MISO_H2_B: JP2.3 ; port ENCODER_HALL.MISO_H2_B
ENC_HALL.MOSI_H1_A: JP2.2 ; port ENCODER_HALL.MOSI_H1_A
ENC_HALL.SCK_H3_I: JP2.4 ; port ENCODER_HALL.SCK_H3_I
USB.DM: JP3.2(D-) ; port USB.DM
USB.DP: JP3.3(D+) ; port USB.DP
NetJP4_1: JP4.1 JP4.3 ; port CAN.CANH
NetJP4_2: JP4.2 JP4.4 ; port CAN.CANL

Not connected (* = marked no-connect by the designer): JP3 4(ID)*

### Library data of the parts
JP1 = JST_PH_7_VERT: PartNumber: B7B-PH-K-S(LF)(SN); Manufacturer: JST Sales America Inc.; Mounting Technology: Through Hole; PackageReference: JST-PH
JP2 = JST_PH_6_VERT: PartNumber: B6B-PH-K-S(LF)(SN); Manufacturer: JST Sales America Inc.; PackageReference: JST-PH; Mounting Technology: Through Hole
JP3 = USB_MICROB_SMT: pin to pad: 1>VBUS 2>D- 3>D+ 4>ID 5>GND 6>MT1+P$1+P$2+MT2; PartNumber: 10118192-0001LF; Manufacturer: Amphenol FCI; Mounting Technology: Surface Mount; PackageReference: USB - Micro B
JP4 = JST_PH_4_VERT: PartNumber: B4B-PH-K-S(LF)(SN); Manufacturer: JST Sales America Inc.; PackageReference: JST-PH; Mounting Technology: Through Hole

## Sheet MotorPhase.SchDoc
size A; DocumentNumber: 3; SheetNumber: 3; SheetTotal: 6
Used 3 times, as channels A, B, C. Parts and nets are listed once, with the designators drawn on the sheet.
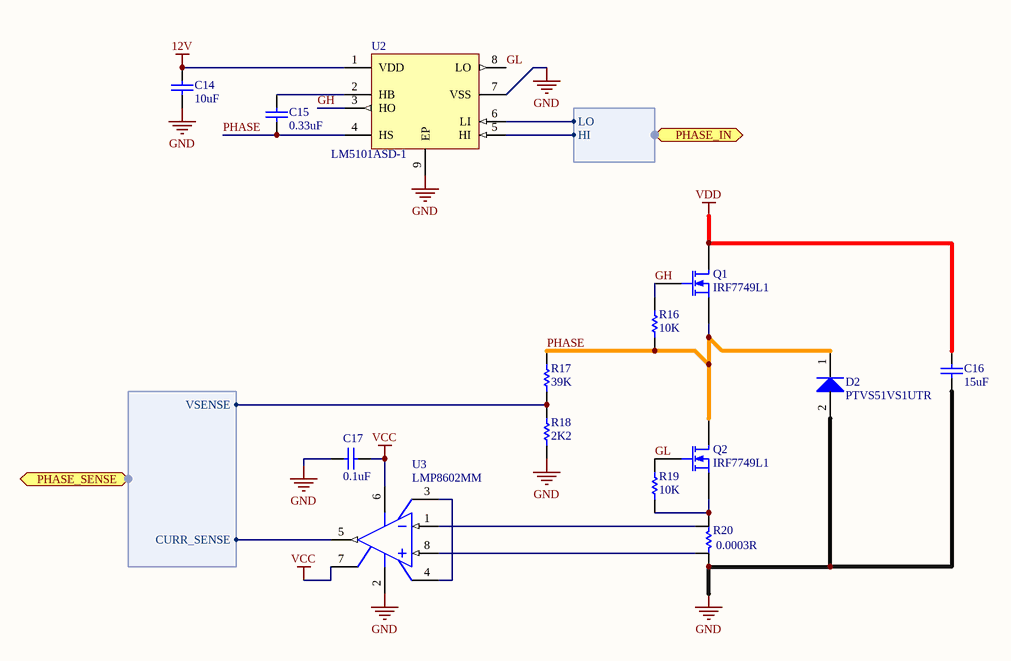
[diagram p6: MotorPhase.SchDoc]

### Parts
C14  value 10uF  [C0603[1608X92]]  (hidden comment: 10uF 16V 0603)
C15  value 0.33uF  [C0603[1608X92]]  (hidden comment: 0.33uF 25V 0603)
C16  value 15uF  [C2220[5750X230]]  (hidden comment: 15uF 100V 2220)
C17  value 0.1uF  [C0402[1005X55]]  (hidden comment: 0.1uF 6.3V 0402)
D2  PTVS51VS1UTR  [SOD-123W]
Q1  IRF7749L1  [DIRECTFET-9]
Q2  IRF7749L1  [DIRECTFET-9]
R16  value 10K  [R0402[1005]]  (hidden comment: 10K 1% 0402)
R17  value 39K  [R0402[1005]]  (hidden comment: 39K 1% 0402)
R18  value 2K2  [R0402[1005]]  (hidden comment: 2K2 1% 0402)
R19  value 10K  [R0402[1005]]  (hidden comment: 10K 1% 0402)
R20  value 0.0003R  [WSL2726]
U2  LM5101ASD-1  [DFN8]
U3  LMP8602MM  [MUA08A_L]

### Ports
PHASE_IN (harness Phase Input), PHASE_SENSE (harness Phase Sense)

### Harnesses
Phase Sense: VSENSE, CURR_SENSE
Phase Input: LO, HI

### Nets
12V: C14.2 U2.1(VDD)
GND: C14.1 C16.1 C17.2 D2.2(A) R18.1 R20.1 U2.7(VSS) U2.9(EP) U3.2(GND)
VCC: C17.1 U3.6(VS) U3.7(OFS)
VDD: C16.2 Q1.3(D)
GH: Q1.1(G) R16.2 U2.3(HO)
GL: Q2.1(G) R19.2 U2.8(LO)
PHASE: C15.1 D2.1(K) Q1.2(S) Q2.3(D) R16.1 R17.2 U2.4(HS)
NetC15_2: C15.2 U2.2(HB)
NetQ2_2: Q2.2(S) R19.1 R20.2
NetR17_1: R17.1 R18.2 ; port PHASE_SENSE.VSENSE
NetR20_3: R20.3 U3.8(IN+)
NetR20_4: R20.4 U3.1(IN-)
NetU2_5: U2.5(HI) ; port PHASE_IN.HI
NetU2_6: U2.6(LI) ; port PHASE_IN.LO
NetU3_3: U3.3(A1) U3.4(A2)
NetU3_5: U3.5(OUT) ; port PHASE_SENSE.CURR_SENSE

### Channels
A: designators C14=C33#2 C15=C15A C16=C25#2 C17=C17A D2=D3#2 Q1=Q1 Q2=Q4#2 R16=R28#2 R17=R7#2 R18=R13#2 R19=R31#2 R20=R10#2 U2=U4#2 U3=U3A
B: designators end in B
C: designators end in C

### Library data of the parts
C14 = CAP_10uF_16V_0603_10%: 10uF 16V 10% 0603 (1608 Metric); PartNumber: GRM188R61C106KAALD; Manufacturer: Murata; Tolerance: 10%; Mounting Technology: Surface Mount; PackageReference: 0603; PackageDescription: 0603 (1608 Metric); Voltage: 16V
C15 = CAP_0.33uF_25V_0603_10%: 0.33uF 25V 10% 0603 (1608 Metric); PartNumber: GCJ188R91E334KA01D; Manufacturer: Murata; Tolerance: 10%; Mounting Technology: Surface Mount; PackageReference: 0603; PackageDescription: 0603 (1608 Metric); Voltage: 25V
C16 = CAP_15uF_100V_2220_20%: 15uF 100V 20% 2220 (5750 Metric); PartNumber: C5750X7S2A156M250KB; Manufacturer: TDK; Tolerance: 20%; Mounting Technology: Surface Mount; PackageReference: 2220; PackageDescription: 2220 (5750 Metric); Voltage: 100V
C17 = CAP_0.1uF_6.3V_0402_10%: as C10 on sheet MCU; Tolerance: 10%; Mounting Technology: Surface Mount; PackageReference: 0402; PackageDescription: 0402 (1005 Metric); Voltage: 6.3V
D2 = PTVS51VS1UTR,115: Manufacturer: NXP; PartNumber: PTVS51VS1UTR,115; PackageReference: SOD-123W; PackageDescription: SOD123W, 2-Leads; Mounting Technology: Surface Mount
Q1 Q2 = IRF7749L2: N-Channel MOSFET; PartNumber: IRF7749L1TRPBF; Manufacturer: Infineon Technologies; PackageReference: DIRECTFET L8; PackageDescription: DirectFET™ Isometric L8; Mounting Technology: Surface Mount
R16 R19 = RES_10K_0402_1%: as R22 on sheet 12V; Tolerance: 1%; Power: 0.063W; Mounting Technology: Surface Mount; PackageReference: 0402; PackageDescription: 0402 (1005 Metric); ComponentLink1Description: Datasheet; ComponentLink1URL: http://www.koaspeer.com/catimages/Products/RK73H/RK73H.pdf
R17 = RES_39K_0402_1%: 39K 0.063W 1% 0402 (1005 Metric); Manufacturer: KOA Speer; PartNumber: RK73H1ETTP3902F; Tolerance: 1%; Power: 0.063W; Mounting Technology: Surface Mount; PackageReference: 0402; PackageDescription: 0402 (1005 Metric); ComponentLink1Description: Datasheet; ComponentLink1URL: http://www.koaspeer.com/catimages/Products/RK73H/RK73H.pdf
R18 = RES_2K2_0402_1%: 2K2 0.063W 1% 0402 (1005 Metric); Manufacturer: KOA Speer; PartNumber: RK73H1ETTP2201F; Tolerance: 1%; Power: 0.063W; Mounting Technology: Surface Mount; PackageReference: 0402; PackageDescription: 0402 (1005 Metric); ComponentLink1Description: Datasheet; ComponentLink1URL: http://www.koaspeer.com/catimages/Products/RK73H/RK73H.pdf
R20 = WSL27261L000FEB: Current Sense Resistor, 0.0003R 1%; PartNumber: WSL2726L3000FEB; Manufacturer: Vishay; Power: 3W; PackageReference: 2726; PackageDescription: 2726 (6966 metric); Mounting Technology: Surface Mount
U2 = LM5101ASD-1: Manufacturer: Texas Instruments; PartNumber: LM5101ASD-1; PackageReference: 8-WSON; PackageDescription: 8-WDFN Exposed Pad; Mounting Technology: Surface Mount
U3 = CMP-0055-01489-1: 60V Common Mode, 50 x Gain, Bidirectional Precision Current Sensing Amplifier, 8-pin Mini SOIC, Pb-Free; Manufacturer: Texas Instruments; CompType: Amplifiers; PowerWise: N; PackageTopMarking: ZXTT*AN3A; PackageVersion: revF, Apr-2008; PackageReference: 8-VSSOP; PackageDescription: MINI SOIC, .118 x .118 x .034in, 8 Lead, .0256in Pitch; Code_JEDEC: MO-187-AA; DatasheetVersion: Mar-2010; RoHS: Y; PinCount: 8; PartNumber: LMP8602MM; Mounting Technology: Surface Mount

## Nets that join several sheets
5V: 3V3 (5 pins), Connectors (JP1.7 JP2.6)
12V: 12V (8 pins), A (C33#2.2 U4#2.1), B (C14B.2 U2B.1), C (C14C.2 U2C.1)
GND: ESC (C32.2 D12.2 D13.C), 12V (15 pins), 3V3 (16 pins), MCU (22 pins), CAN (C33#1.1 U7.2), Connectors (JP1.1 JP2.1 JP3.5 JP3.6), A (9 pins), B (9 pins), C (9 pins)
VCC: 12V (R27.2), 3V3 (5 pins), MCU (21 pins), CAN (C33#1.2 U7.3), Connectors (JP1.6), A (C17A.1 U3A.6 U3A.7), B (C17B.1 U3B.6 U3B.7), C (C17C.1 U3C.6 U3C.7)
VDD: ESC (C32.1 D12.1 R30.2), 12V (9 pins), 3V3 (C18.2 U4#1.2 U4#1.3), MCU (R10#1.1), A (C25#2.2 Q1.3), B (C16B.2 Q1B.3), C (C16C.2 Q1C.3)
VUSB: 3V3 (D4.1 D7.2), Connectors (JP3.1)
NetJP4_1: CAN (R31#1.2 U7.7), Connectors (JP4.1 JP4.3)
NetJP4_2: CAN (R31#1.1 U7.6), Connectors (JP4.2 JP4.4)
NetQ6_1: 12V (Q6.1 R29.2), MCU (U1#1.17)